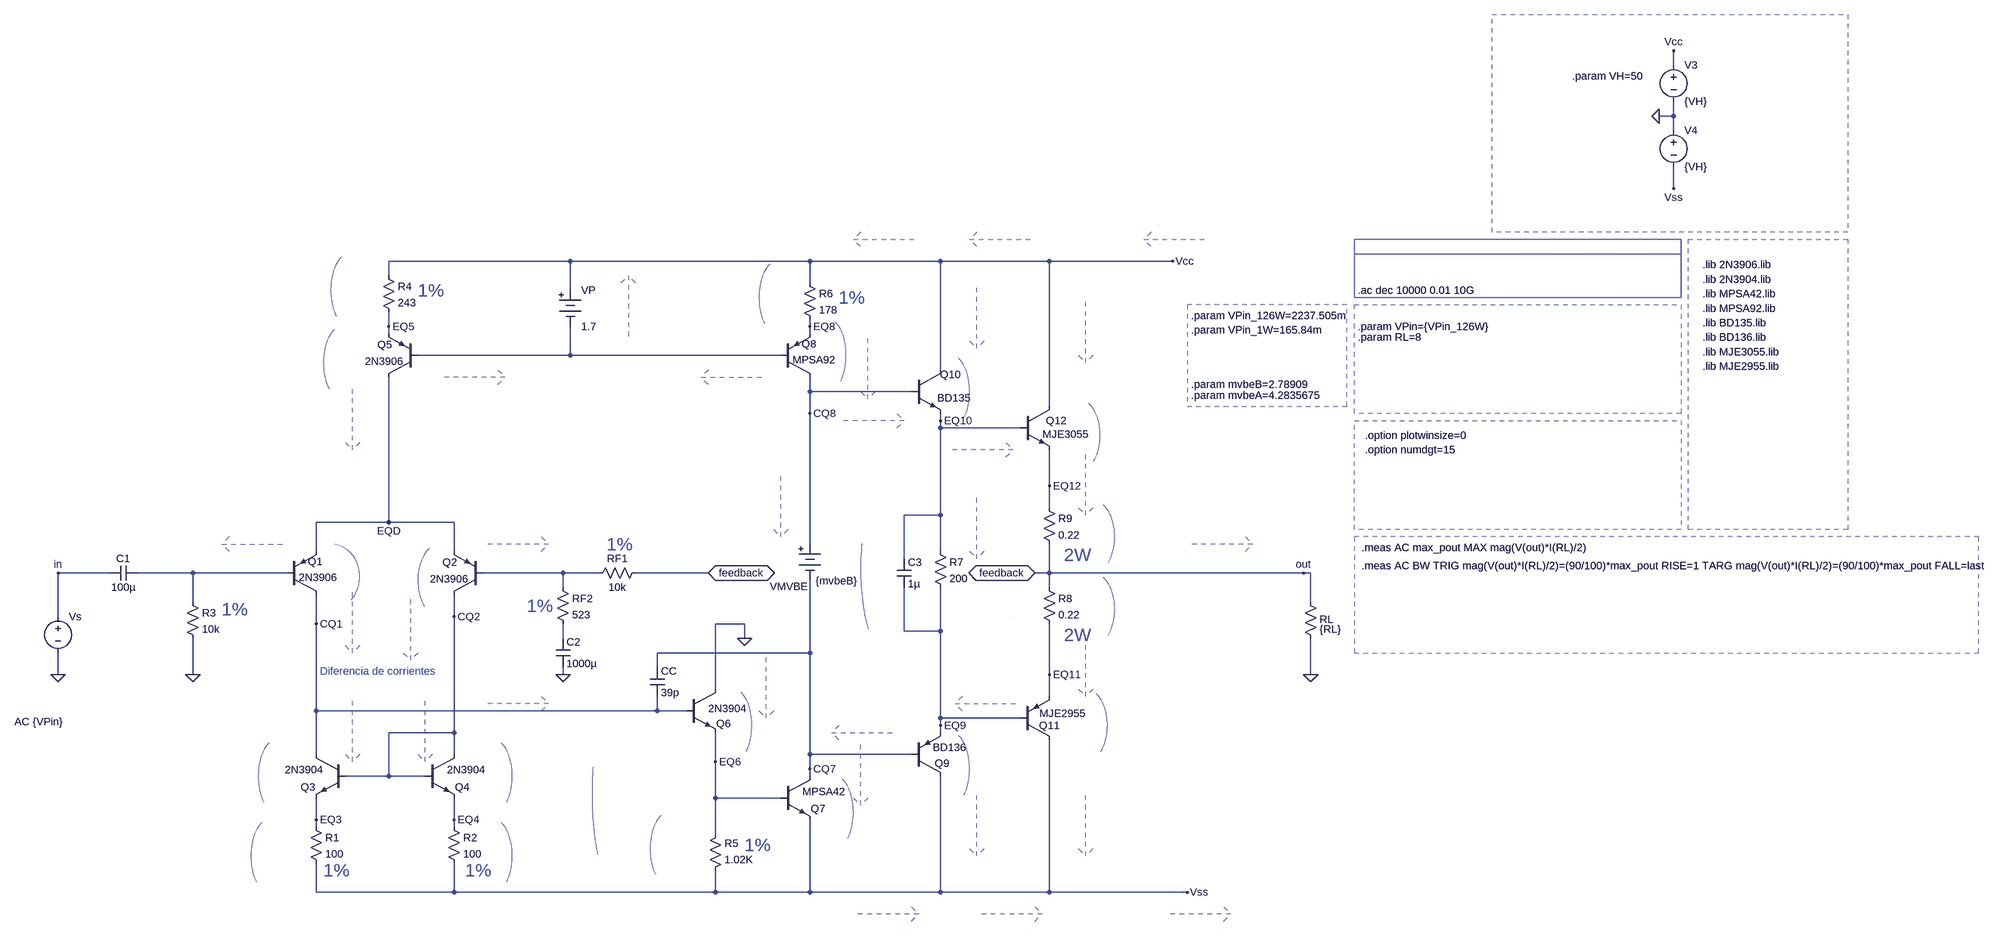
[diagram p0: schematic amplifier_POWER_BW.asc]
amplifier_POWER_BW.asc, the LTspice schematic file:
Version 4
SHEET 1 5060 1908
WIRE 3856 -512 3856 -544
WIRE 3856 -400 3856 -432
WIRE 3856 -400 3824 -400
WIRE 3856 -368 3856 -400
WIRE 3856 -240 3856 -288
WIRE 1424 -80 1024 -80
WIRE 1952 -80 1424 -80
WIRE 2240 -80 1952 -80
WIRE 2480 -80 2240 -80
WIRE 2752 -80 2480 -80
WIRE 1024 -48 1024 -80
WIRE 1952 -32 1952 -80
WIRE 1424 -16 1424 -80
WIRE 1024 64 1024 32
WIRE 1952 64 1952 48
WIRE 1024 80 1024 64
WIRE 1952 80 1952 64
WIRE 1424 128 1424 64
WIRE 1424 128 1088 128
WIRE 1888 128 1424 128
WIRE 2240 160 2240 -80
WIRE 1952 208 1952 176
WIRE 2176 208 1952 208
WIRE 2480 240 2480 -80
WIRE 1952 256 1952 208
WIRE 2240 272 2240 256
WIRE 2240 288 2240 272
WIRE 2416 288 2240 288
WIRE 2480 416 2480 336
WIRE 2480 464 2480 416
WIRE 2240 480 2240 288
WIRE 2240 480 2160 480
WIRE 1024 496 1024 176
WIRE 1024 496 864 496
WIRE 1168 496 1024 496
WIRE 1952 544 1952 256
WIRE 864 560 864 496
WIRE 1168 560 1168 496
WIRE 2240 560 2240 480
WIRE 2160 576 2160 480
WIRE 352 608 240 608
WIRE 592 608 416 608
WIRE 800 608 592 608
WIRE 1408 608 1232 608
WIRE 1488 608 1408 608
WIRE 1728 608 1568 608
WIRE 2480 608 2480 544
WIRE 2480 608 2448 608
WIRE 3040 608 2480 608
WIRE 3056 608 3040 608
WIRE 1408 640 1408 608
WIRE 2480 640 2480 608
WIRE 592 672 592 608
WIRE 3056 672 3056 608
WIRE 240 704 240 608
WIRE 1168 704 1168 656
WIRE 864 720 864 656
WIRE 1808 720 1744 720
WIRE 2160 736 2160 640
WIRE 2240 736 2240 640
WIRE 2240 736 2160 736
WIRE 1408 752 1408 720
WIRE 1808 752 1808 720
WIRE 1952 784 1952 624
WIRE 1952 784 1616 784
WIRE 1616 816 1616 784
WIRE 240 832 240 784
WIRE 592 832 592 752
WIRE 1408 832 1408 816
WIRE 2480 832 2480 720
WIRE 3056 832 3056 752
WIRE 1744 864 1744 720
WIRE 2480 880 2480 832
WIRE 864 912 864 720
WIRE 1616 912 1616 880
WIRE 1616 912 864 912
WIRE 1680 912 1616 912
WIRE 2240 928 2240 736
WIRE 2416 928 2240 928
WIRE 2240 944 2240 928
WIRE 1168 960 1168 704
WIRE 1168 960 1024 960
WIRE 2240 960 2240 944
WIRE 864 1008 864 912
WIRE 1168 1008 1168 960
WIRE 1952 1008 1952 784
WIRE 2176 1008 1952 1008
WIRE 1744 1024 1744 960
WIRE 1952 1040 1952 1008
WIRE 1024 1056 1024 960
WIRE 1024 1056 928 1056
WIRE 1104 1056 1024 1056
WIRE 1952 1056 1952 1040
WIRE 1744 1104 1744 1024
WIRE 1888 1104 1744 1104
WIRE 864 1152 864 1104
WIRE 1168 1152 1168 1104
WIRE 864 1168 864 1152
WIRE 1168 1168 1168 1152
WIRE 1744 1184 1744 1104
WIRE 864 1312 864 1248
WIRE 1168 1312 1168 1248
WIRE 1168 1312 864 1312
WIRE 1744 1312 1744 1264
WIRE 1744 1312 1168 1312
WIRE 1952 1312 1952 1152
WIRE 1952 1312 1744 1312
WIRE 2240 1312 2240 1056
WIRE 2240 1312 1952 1312
WIRE 2480 1312 2480 976
WIRE 2480 1312 2240 1312
WIRE 2784 1312 2480 1312
FLAG 3824 -400 0
FLAG 3856 -544 Vcc
FLAG 3856 -240 Vss
FLAG 240 832 0
FLAG 240 608 in
FLAG 2752 -80 Vcc
FLAG 3056 832 0
FLAG 2784 1312 Vss
FLAG 3040 608 out
FLAG 2448 608 feedback
IOPIN 2448 608 BiDir
FLAG 864 720 CQ1
FLAG 1168 704 CQ2
FLAG 1808 752 0
FLAG 1408 832 0
FLAG 1728 608 feedback
IOPIN 1728 608 BiDir
FLAG 592 832 0
FLAG 1024 496 EQD
FLAG 1024 64 EQ5
FLAG 864 1152 EQ3
FLAG 1168 1152 EQ4
FLAG 2480 832 EQ11
FLAG 2480 416 EQ12
FLAG 1952 64 EQ8
FLAG 1952 256 CQ8
FLAG 1952 1040 CQ7
FLAG 2240 272 EQ10
FLAG 2240 944 EQ9
FLAG 1744 1024 EQ6
DATAFLAG 2608 944 "V(EQ11,Vss)"
DATAFLAG 2320 1168 "-Ic(Q9)"
DATAFLAG 2624 528 "V(EQ12,out)"
DATAFLAG 2624 688 "V(out,EQ11)"
DATAFLAG 2624 -80 ""
DATAFLAG 2640 1312 ""
DATAFLAG 2784 -128 "-I(V3)"
DATAFLAG 2784 1360 "-I(V4)"
DATAFLAG 944 592 "V(EQD,CQ1)"
DATAFLAG 1088 656 "V(EQD,CQ2)"
DATAFLAG 1008 864 "Ic(Q1)-Ic(Q2)"
DATAFLAG 944 272 "-Ic(Q5)"
DATAFLAG 944 720 "-Ic(Q1)"
DATAFLAG 1072 736 "-Ic(Q2)"
DATAFLAG 2848 608 ""
DATAFLAG 2560 80 "Ic(Q12)"
DATAFLAG 2560 1168 "-Ic(Q11)"
DATAFLAG 2080 160 "-Ic(Q8)"
DATAFLAG 2064 1056 "Ic(Q7)"
DATAFLAG 1856 864 "Ic(Q6)"
DATAFLAG 2320 48 "Ic(Q10)"
DATAFLAG 2320 512 "I(R7)"
DATAFLAG 624 608 ""
DATAFLAG 1648 608 ""
DATAFLAG 1408 608 ""
DATAFLAG 880 144 "V(EQ5,EQD)"
DATAFLAG 736 1056 "V(CQ1,EQ3)"
DATAFLAG 1296 1072 "V(CQ2,EQ4)"
DATAFLAG 2592 272 "V(Vcc,EQ12)"
DATAFLAG 1472 1104 "V(CQ1,Vss)"
DATAFLAG 2032 128 "V(EQ8,CQ8)"
DATAFLAG 2048 1168 "V(CQ7)-V(Vss)"
DATAFLAG 2304 208 "V(Vcc,EQ10)"
DATAFLAG 2304 1056 "V(EQ9,Vss)"
DATAFLAG 1824 944 "-V(EQ6)"
DATAFLAG 2064 608 "V(EQ10,EQ9)"
DATAFLAG 720 1232 "V(EQ3,Vss)"
DATAFLAG 1296 1232 "V(EQ4,Vss)"
DATAFLAG 1312 544 "-Ib(Q2)"
DATAFLAG 720 544 "-Ib(Q1)"
DATAFLAG 1600 1216 "V(EQ6,Vss)"
DATAFLAG 896 -16 "V(Vcc,EQ5)"
DATAFLAG 1504 912 ""
DATAFLAG 1168 864 ""
DATAFLAG 864 880 ""
DATAFLAG 2336 336 "Ib(Q12)"
DATAFLAG 2336 896 "-Ib(Q11)"
DATAFLAG 2096 272 "Ib(Q10)"
DATAFLAG 2064 960 "-Ib(Q9)"
DATAFLAG 1312 896 "Ib(Q6)"
DATAFLAG 1840 0 "V(Vcc,EQ8)"
DATAFLAG 1216 176 "-Ib(Q5)"
DATAFLAG 1776 176 "-Ib(Q8)"
DATAFLAG 1552 16 "-I(VP)"
DATAFLAG 1888 464 "I(VMVBE)"
DATAFLAG 2560 416 "-Ie(Q12)"
DATAFLAG 2560 816 "Ie(Q11)"
DATAFLAG 2864 544 "I(RL)"
DATAFLAG 1952 928 ""
DATAFLAG 1952 352 ""
DATAFLAG 1504 128 ""
DATAFLAG 944 960 "Ic(Q3)"
DATAFLAG 1104 960 "Ic(Q4)"
DATAFLAG 2400 -128 "-I(V3)-Ic(Q12)"
DATAFLAG 2368 1360 "-I(V4)+Ic(Q11)"
DATAFLAG 2144 -128 "-I(V3)-Ic(Q12)-Ic(Q10)"
DATAFLAG 2096 1360 "-I(V4)+Ic(Q11)+Ic(Q9)"
SYMBOL voltage 3856 -528 R0
WINDOW 123 0 0 Left 0
WINDOW 39 0 0 Left 0
SYMATTR InstName V3
SYMATTR Value {VH}
SYMBOL voltage 3856 -384 R0
WINDOW 123 0 0 Left 0
WINDOW 39 0 0 Left 0
SYMATTR InstName V4
SYMATTR Value {VH}
SYMBOL voltage 240 688 R0
WINDOW 123 -96 248 Left 2
WINDOW 39 0 0 Left 0
WINDOW 3 -95 208 Left 2
SYMATTR Value2 AC {VPin}
SYMATTR Value ""
SYMATTR InstName Vs
SYMBOL res 3040 656 R0
WINDOW 0 36 54 Left 2
SYMATTR InstName RL
SYMATTR Value {RL}
SYMBOL res 2464 624 R0
SYMATTR InstName R8
SYMATTR Value 0.22
SYMBOL res 2464 448 R0
SYMATTR InstName R9
SYMATTR Value 0.22
SYMBOL npn 2176 160 R0
WINDOW 0 63 10 Left 2
WINDOW 3 57 62 Left 2
SYMATTR InstName Q10
SYMATTR Value BD135
SYMBOL npn 2416 240 R0
WINDOW 3 49 62 Left 2
SYMATTR Value MJE3055
SYMATTR InstName Q12
SYMBOL pnp 2416 976 M180
WINDOW 0 41 32 Left 2
WINDOW 3 42 58 Left 2
SYMATTR InstName Q11
SYMATTR Value MJE2955
SYMBOL pnp 2176 1056 M180
WINDOW 0 51 28 Left 2
WINDOW 3 47 63 Left 2
SYMATTR InstName Q9
SYMATTR Value BD136
SYMBOL cap 2144 576 R0
SYMATTR InstName C3
SYMATTR Value 1µ
SYMBOL res 2224 544 R0
SYMATTR InstName R7
SYMATTR Value 200
SYMBOL pnp 800 656 M180
WINDOW 3 26 38 Left 2
WINDOW 0 46 73 Left 2
SYMATTR Value 2N3906
SYMATTR InstName Q1
SYMBOL pnp 1232 656 R180
WINDOW 0 57 72 Left 2
WINDOW 3 32 35 Left 2
SYMATTR InstName Q2
SYMATTR Value 2N3906
SYMBOL res 848 1152 R0
SYMATTR InstName R1
SYMATTR Value 100
SYMBOL res 1152 1152 R0
SYMATTR InstName R2
SYMATTR Value 100
SYMBOL npn 1104 1008 R0
WINDOW 3 48 34 Left 2
WINDOW 0 66 72 Left 2
SYMATTR Value 2N3904
SYMATTR InstName Q4
SYMBOL npn 928 1008 M0
WINDOW 3 48 34 Left 2
WINDOW 0 66 72 Left 2
SYMATTR Value 2N3904
SYMATTR InstName Q3
SYMBOL pnp 1088 176 R180
WINDOW 0 57 72 Left 2
WINDOW 3 32 35 Left 2
SYMATTR InstName Q5
SYMATTR Value 2N3906
SYMBOL res 1008 -64 R0
SYMATTR InstName R4
SYMATTR Value 243
SYMBOL Misc\\battery 1424 -32 R0
WINDOW 123 0 0 Left 0
WINDOW 39 0 0 Left 0
SYMATTR InstName VP
SYMATTR Value 1.7
SYMBOL res 1936 -48 R0
SYMATTR InstName R6
SYMATTR Value 178
SYMBOL pnp 1888 176 M180
WINDOW 3 26 38 Left 2
WINDOW 0 46 73 Left 2
SYMATTR Value MPSA92
SYMATTR InstName Q8
SYMBOL npn 1888 1056 R0
WINDOW 3 48 34 Left 2
WINDOW 0 66 72 Left 2
SYMATTR Value MPSA42
SYMATTR InstName Q7
SYMBOL Misc\\battery 1952 528 R0
WINDOW 123 0 0 Left 0
WINDOW 39 0 0 Left 0
WINDOW 0 -88 110 Left 2
WINDOW 3 13 97 Left 2
SYMATTR InstName VMVBE
SYMATTR Value {mvbeB}
SYMBOL res 1728 1280 M180
WINDOW 0 36 76 Left 2
WINDOW 3 36 40 Left 2
SYMATTR InstName R5
SYMATTR Value 1.02K
SYMBOL npn 1680 864 R0
WINDOW 3 48 43 Left 2
WINDOW 0 66 76 Left 2
SYMATTR Value 2N3904
SYMATTR InstName Q6
SYMBOL res 1392 624 R0
SYMATTR InstName RF2
SYMATTR Value 523
SYMBOL res 1584 592 R90
WINDOW 0 0 56 VBottom 2
WINDOW 3 32 56 VTop 2
SYMATTR InstName RF1
SYMATTR Value 10k
SYMBOL res 576 656 R0
SYMATTR InstName R3
SYMATTR Value 10k
SYMBOL cap 1600 816 R0
SYMATTR InstName CC
SYMATTR Value 39p
SYMBOL cap 1392 752 R0
SYMATTR InstName C2
SYMATTR Value 1000µ
SYMBOL cap 416 592 R90
WINDOW 0 0 32 VBottom 2
WINDOW 3 32 32 VTop 2
SYMATTR InstName C1
SYMATTR Value 100µ
TEXT 3632 -488 Left 2 !.param VH=50
TEXT 2792 40 Left 2 !.param VPin_126W=2237.505m
TEXT 2792 72 Left 2 !.param VPin_1W=165.84m
TEXT 872 824 Left 2 ;Diferencia de corrientes
TEXT 1088 -16 Left 4 ;1%
TEXT 2016 0 Left 4 ;1%
TEXT 1328 680 Left 4 ;1%
TEXT 1504 544 Left 4 ;1%
TEXT 1808 1208 Left 4 ;1%
TEXT 656 688 Left 4 ;1%
TEXT 880 1264 Left 4 ;1%
TEXT 1192 1264 Left 4 ;1%
TEXT 2512 568 Left 4 ;2W
TEXT 2512 744 Left 4 ;2W
TEXT 2792 192 Left 2 !.param mvbeB=2.78909
TEXT 2792 216 Left 2 !.param mvbeA=4.2835675
TEXT 3920 56 Left 2 !.lib BD135.lib
TEXT 3920 88 Left 2 !.lib BD136.lib
TEXT 3920 -8 Left 2 !.lib MPSA42.lib
TEXT 3920 24 Left 2 !.lib MPSA92.lib
TEXT 3920 -40 Left 2 !.lib 2N3904.lib
TEXT 3920 -72 Left 2 !.lib 2N3906.lib
TEXT 3920 120 Left 2 !.lib MJE3055.lib
TEXT 3920 152 Left 2 !.lib MJE2955.lib
TEXT 3160 -16 Left 2 !.ac dec 10000 0.01 10G
TEXT 3160 64 Left 2 !.param VPin={VPin_126W}
TEXT 3160 88 Left 2 !.param RL=8
TEXT 3176 304 Left 2 !.option plotwinsize=0
TEXT 3176 336 Left 2 !.option numdgt=15
TEXT 3168 592 Left 2 !.meas AC BW TRIG mag(V(out)*I(RL)/2)=(90/100)*max_pout RISE=1 TARG mag(V(out)*I(RL)/2)=(90/100)*max_pout FALL=last
TEXT 3168 552 Left 2 !.meas AC max_pout MAX mag(V(out)*I(RL)/2)
LINE Normal 2288 224 2288 224 2
LINE Normal 2288 224 2288 224 2
LINE Normal 2272 208 2272 208 2
LINE Normal 2256 192 2256 192 2
LINE Normal 2320 1232 2320 1088 2
LINE Normal 2320 1232 2320 1232 2
LINE Normal 2320 1232 2320 1232 2
LINE Normal 2304 1216 2320 1232 2
LINE Normal 2304 1216 2304 1216 2
LINE Normal 2336 1216 2320 1232 2
LINE Normal 2288 992 2288 992 2
LINE Normal 2400 704 2400 704 2
LINE Normal 2688 -128 2832 -128 2
LINE Normal 2688 -128 2688 -128 2
LINE Normal 2688 -128 2688 -128 2
LINE Normal 2704 -144 2688 -128 2
LINE Normal 2704 -144 2704 -144 2
LINE Normal 2704 -112 2688 -128 2
LINE Normal 2720 -160 2720 -160 2
LINE Normal 2880 1360 2736 1360 2
LINE Normal 2880 1360 2880 1360 2
LINE Normal 2880 1360 2880 1360 2
LINE Normal 2864 1376 2880 1360 2
LINE Normal 2864 1376 2864 1376 2
LINE Normal 2864 1344 2880 1360 2
LINE Normal 2848 1392 2848 1392 2
LINE Normal 944 336 944 192 2
LINE Normal 944 336 944 336 2
LINE Normal 944 336 944 336 2
LINE Normal 928 320 944 336 2
LINE Normal 928 320 928 320 2
LINE Normal 960 320 944 336 2
LINE Normal 944 784 944 640 2
LINE Normal 944 784 944 784 2
LINE Normal 944 784 944 784 2
LINE Normal 928 768 944 784 2
LINE Normal 928 768 928 768 2
LINE Normal 960 768 944 784 2
LINE Normal 1072 800 1072 656 2
LINE Normal 1072 800 1072 800 2
LINE Normal 1072 800 1072 800 2
LINE Normal 1056 784 1072 800 2
LINE Normal 1056 784 1056 784 2
LINE Normal 1088 784 1072 800 2
LINE Normal 2560 144 2560 0 2
LINE Normal 2560 144 2560 144 2
LINE Normal 2560 144 2560 144 2
LINE Normal 2544 128 2560 144 2
LINE Normal 2544 128 2544 128 2
LINE Normal 2576 128 2560 144 2
LINE Normal 2560 1232 2560 1088 2
LINE Normal 2560 1232 2560 1232 2
LINE Normal 2560 1232 2560 1232 2
LINE Normal 2544 1216 2560 1232 2
LINE Normal 2544 1216 2544 1216 2
LINE Normal 2576 1216 2560 1232 2
LINE Normal 2080 224 2080 80 2
LINE Normal 2080 224 2080 224 2
LINE Normal 2080 224 2080 224 2
LINE Normal 2064 208 2080 224 2
LINE Normal 2064 208 2064 208 2
LINE Normal 2096 208 2080 224 2
LINE Normal 2064 1120 2064 976 2
LINE Normal 2064 1120 2064 1120 2
LINE Normal 2064 1120 2064 1120 2
LINE Normal 2048 1104 2064 1120 2
LINE Normal 2048 1104 2048 1104 2
LINE Normal 2080 1104 2064 1120 2
LINE Normal 1856 928 1856 784 2
LINE Normal 1856 928 1856 928 2
LINE Normal 1856 928 1856 928 2
LINE Normal 1840 912 1856 928 2
LINE Normal 1840 912 1840 912 2
LINE Normal 1872 912 1856 928 2
LINE Normal 2320 112 2320 -32 2
LINE Normal 2320 112 2320 112 2
LINE Normal 2320 112 2320 112 2
LINE Normal 2304 96 2320 112 2
LINE Normal 2304 96 2304 96 2
LINE Normal 2336 96 2320 112 2
LINE Normal 2320 576 2320 432 2
LINE Normal 2320 576 2320 576 2
LINE Normal 2320 576 2320 576 2
LINE Normal 2304 560 2320 576 2
LINE Normal 2304 560 2304 560 2
LINE Normal 2336 560 2320 576 2
LINE Normal 1376 544 1232 544 2
LINE Normal 1376 544 1376 544 2
LINE Normal 1376 544 1376 544 2
LINE Normal 1360 560 1376 544 2
LINE Normal 1360 560 1360 560 2
LINE Normal 1360 528 1376 544 2
LINE Normal 656 544 800 544 2
LINE Normal 656 544 656 544 2
LINE Normal 656 544 656 544 2
LINE Normal 672 560 656 544 2
LINE Normal 672 560 672 560 2
LINE Normal 672 528 656 544 2
LINE Normal 2400 336 2256 336 2
LINE Normal 2400 336 2400 336 2
LINE Normal 2400 336 2400 336 2
LINE Normal 2384 352 2400 336 2
LINE Normal 2384 352 2384 352 2
LINE Normal 2384 320 2400 336 2
LINE Normal 2272 896 2416 896 2
LINE Normal 2272 896 2272 896 2
LINE Normal 2272 896 2272 896 2
LINE Normal 2288 912 2272 896 2
LINE Normal 2288 912 2288 912 2
LINE Normal 2288 880 2272 896 2
LINE Normal 2160 272 2016 272 2
LINE Normal 2160 272 2160 272 2
LINE Normal 2160 272 2160 272 2
LINE Normal 2144 288 2160 272 2
LINE Normal 2144 288 2144 288 2
LINE Normal 2144 256 2160 272 2
LINE Normal 2000 960 2144 960 2
LINE Normal 2000 960 2000 960 2
LINE Normal 2000 960 2000 960 2
LINE Normal 2016 976 2000 960 2
LINE Normal 2016 976 2016 976 2
LINE Normal 2016 944 2000 960 2
LINE Normal 1376 896 1232 896 2
LINE Normal 1376 896 1376 896 2
LINE Normal 1376 896 1376 896 2
LINE Normal 1360 912 1376 896 2
LINE Normal 1360 912 1360 912 2
LINE Normal 1360 880 1376 896 2
LINE Normal 1280 176 1136 176 2
LINE Normal 1280 176 1280 176 2
LINE Normal 1280 176 1280 176 2
LINE Normal 1264 192 1280 176 2
LINE Normal 1264 192 1264 192 2
LINE Normal 1264 160 1280 176 2
LINE Normal 1712 176 1856 176 2
LINE Normal 1712 176 1712 176 2
LINE Normal 1712 176 1712 176 2
LINE Normal 1728 192 1712 176 2
LINE Normal 1728 192 1728 192 2
LINE Normal 1728 160 1712 176 2
LINE Normal 1552 -48 1552 96 2
LINE Normal 1552 -48 1552 -48 2
LINE Normal 1552 -48 1552 -48 2
LINE Normal 1568 -32 1552 -48 2
LINE Normal 1568 -32 1568 -32 2
LINE Normal 1536 -32 1552 -48 2
LINE Normal 1888 528 1888 384 2
LINE Normal 1888 528 1888 528 2
LINE Normal 1888 528 1888 528 2
LINE Normal 1872 512 1888 528 2
LINE Normal 1872 512 1872 512 2
LINE Normal 1904 512 1888 528 2
LINE Normal 2560 480 2560 336 2
LINE Normal 2560 480 2560 480 2
LINE Normal 2560 480 2560 480 2
LINE Normal 2544 464 2560 480 2
LINE Normal 2544 464 2544 464 2
LINE Normal 2576 464 2560 480 2
LINE Normal 2560 880 2560 736 2
LINE Normal 2560 880 2560 880 2
LINE Normal 2560 880 2560 880 2
LINE Normal 2544 864 2560 880 2
LINE Normal 2544 864 2544 864 2
LINE Normal 2576 864 2560 880 2
LINE Normal 2928 544 2784 544 2
LINE Normal 2928 544 2928 544 2
LINE Normal 2928 544 2928 544 2
LINE Normal 2912 560 2928 544 2
LINE Normal 2912 560 2912 560 2
LINE Normal 2912 528 2928 544 2
LINE Normal 944 1024 944 880 2
LINE Normal 944 1024 944 1024 2
LINE Normal 944 1024 944 1024 2
LINE Normal 928 1008 944 1024 2
LINE Normal 928 1008 928 1008 2
LINE Normal 960 1008 944 1024 2
LINE Normal 1104 1024 1104 880 2
LINE Normal 1104 1024 1104 1024 2
LINE Normal 1104 1024 1104 1024 2
LINE Normal 1088 1008 1104 1024 2
LINE Normal 1088 1008 1088 1008 2
LINE Normal 1120 1008 1104 1024 2
LINE Normal 2304 -128 2448 -128 2
LINE Normal 2304 -128 2304 -128 2
LINE Normal 2304 -128 2304 -128 2
LINE Normal 2320 -144 2304 -128 2
LINE Normal 2320 -144 2320 -144 2
LINE Normal 2320 -112 2304 -128 2
LINE Normal 2336 -160 2336 -160 2
LINE Normal 2464 1360 2320 1360 2
LINE Normal 2464 1360 2464 1360 2
LINE Normal 2464 1360 2464 1360 2
LINE Normal 2448 1376 2464 1360 2
LINE Normal 2448 1376 2448 1376 2
LINE Normal 2448 1344 2464 1360 2
LINE Normal 2432 1392 2432 1392 2
LINE Normal 2048 -128 2192 -128 2
LINE Normal 2048 -128 2048 -128 2
LINE Normal 2048 -128 2048 -128 2
LINE Normal 2064 -144 2048 -128 2
LINE Normal 2064 -144 2064 -144 2
LINE Normal 2064 -112 2048 -128 2
LINE Normal 2080 -160 2080 -160 2
LINE Normal 2192 1360 2048 1360 2
LINE Normal 2192 1360 2192 1360 2
LINE Normal 2192 1360 2192 1360 2
LINE Normal 2176 1376 2192 1360 2
LINE Normal 2176 1376 2176 1376 2
LINE Normal 2176 1344 2192 1360 2
LINE Normal 2160 1392 2160 1392 2
LINE Normal 3872 -96 3152 -96
LINE Normal 3872 -96 3872 -96 2
LINE Normal 3872 -128 3872 -128 2
RECTANGLE Normal 4240 -144 3456 -624 3
RECTANGLE Normal 2784 240 3136 16 2
RECTANGLE Normal 3872 0 3152 -128
RECTANGLE Normal 3872 256 3152 16 3
RECTANGLE Normal 4240 512 3888 -128 2
RECTANGLE Normal 3872 512 3152 272 3
RECTANGLE Normal 3152 784 4528 528 3
ARC Normal 2512 864 2608 1024 2606 1022 2585 867 2
ARC Normal 2528 448 2624 608 2622 606 2601 451 2
ARC Normal 2528 608 2624 768 2622 766 2601 611 2
ARC Normal 832 544 960 688 958 686 905 547 2
ARC Normal 1184 544 1088 704 1111 547 1090 702 2
ARC Normal 960 64 880 224 903 67 882 222 2
ARC Normal 816 976 736 1136 759 979 738 1134 2
ARC Normal 1216 976 1296 1136 1294 1134 1273 979 2
ARC Normal 2496 224 2592 384 2590 382 2569 227 2
ARC Normal 1552 912 1472 1280 1479 1043 1474 1278 2
ARC Normal 1952 48 2032 208 2030 206 2009 51 2
ARC Normal 1968 1056 2048 1216 2046 1214 2025 1059 2
ARC Normal 2224 128 2304 288 2302 286 2281 131 2
ARC Normal 2224 960 2304 1120 2302 1118 2281 963 2
ARC Normal 1744 864 1824 1024 1822 1022 1801 867 2
ARC Normal 2176 416 2064 784 2071 547 2066 782 2
ARC Normal 800 1152 720 1312 743 1155 722 1310 2
ARC Normal 1216 1152 1296 1312 1294 1310 1273 1155 2
ARC Normal 1680 1136 1600 1296 1623 1139 1602 1294 2
ARC Normal 976 -96 896 64 919 -93 898 62 2
ARC Normal 1920 -80 1840 80 1863 -77 1842 78 2

The netlist it stands for:
* amplifier_POWER_BW.asc
V3 Vcc 0 {VH}
V4 0 Vss {VH}
Vs in 0 AC {VPin}
RL feedback 0 {RL}
R8 feedback EQ11 0.22
R9 EQ12 feedback 0.22
Q10 Vcc CQ8 EQ10 0 BD135
Q12 Vcc EQ10 EQ12 0 MJE3055
Q11 Vss EQ9 EQ11 0 MJE2955
Q9 Vss CQ7 EQ9 0 BD136
C3 EQ10 EQ9 1µ
R7 EQ10 EQ9 200
Q1 CQ1 N002 EQD 0 2N3906
Q2 CQ2 N003 EQD 0 2N3906
R1 EQ3 Vss 100
R2 EQ4 Vss 100
Q4 CQ2 CQ2 EQ4 0 2N3904
Q3 CQ1 CQ2 EQ3 0 2N3904
Q5 EQD N001 EQ5 0 2N3906
R4 Vcc EQ5 243
VP Vcc N001 1.7
R6 Vcc EQ8 178
Q8 CQ8 N001 EQ8 0 MPSA92
Q7 CQ7 EQ6 Vss 0 MPSA42
VMVBE CQ8 CQ7 {mvbeB}
R5 Vss EQ6 1.02K
Q6 0 CQ1 EQ6 0 2N3904
RF2 N003 N004 523
RF1 feedback N003 10k
R3 N002 0 10k
CC CQ7 CQ1 39p
C2 N004 0 1000µ
C1 N002 in 100µ
.model NPN NPN
.model PNP PNP
.lib standard.bjt
.param VH=50
.param VPin_126W=2237.505m
.param VPin_1W=165.84m
* Diferencia de corrientes
* 1%
* 1%
* 1%
* 1%
* 1%
* 1%
* 1%
* 1%
* 2W
* 2W
.param mvbeB=2.78909
.param mvbeA=4.2835675
.lib BD135.lib
.lib BD136.lib
.lib MPSA42.lib
.lib MPSA92.lib
.lib 2N3904.lib
.lib 2N3906.lib
.lib MJE3055.lib
.lib MJE2955.lib
.ac dec 10000 0.01 10G
.param VPin={VPin_126W}
.param RL=8
.option plotwinsize=0
.option numdgt=15
.meas AC BW TRIG mag(V(out)*I(RL)/2)=(90/100)*max_pout RISE=1 TARG mag(V(out)*I(RL)/2)=(90/100)*max_pout FALL=last
.meas AC max_pout MAX mag(V(out)*I(RL)/2)
.backanno
.end